# Altium schematic sheet memory.SchDoc
size A; SheetNumber: 2; SheetTotal: 3
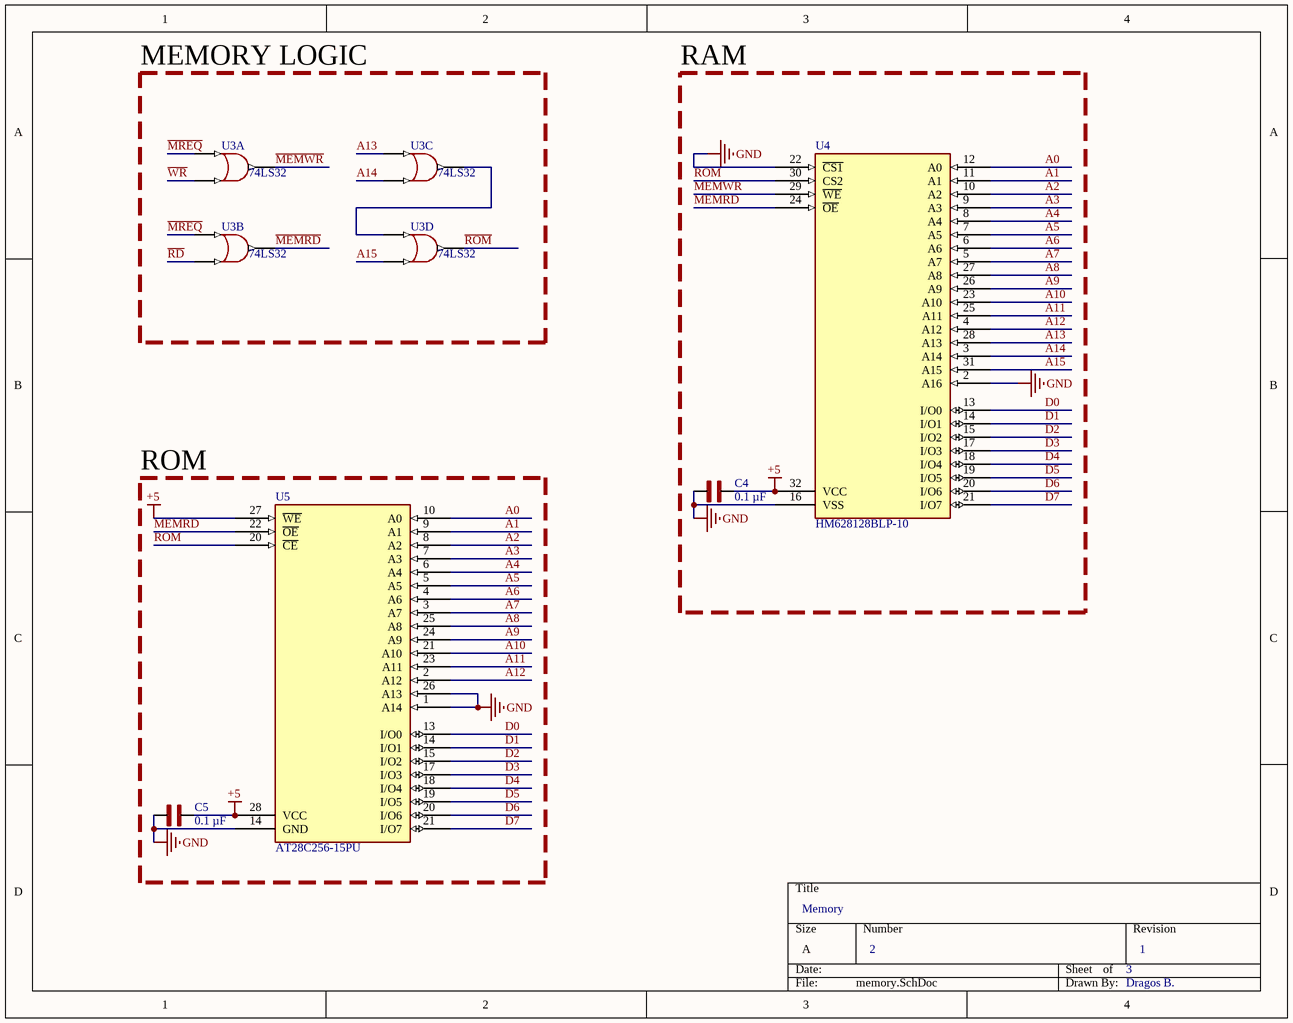
[diagram p0: memory.SchDoc]

## Parts
C4  0.1 µF  [Capacitor]
C5  0.1 µF  [Capacitor]
U3  74LS32  [DIP14]  (parts A,B,C,D of 5)
U4  HM628128BLP-10  [DIP32]
U5  AT28C256-15PU  [DIP28]

## Blocks framed on the sheet
MEMORY LOGIC: U3
RAM: C4 U4
ROM: C5 U5

## Nets
+5: C4.2 C5.2 U4.32(VCC) U5.27(~{WE}) U5.28(VCC)
GND: C4.1 C5.1 U4.2(A16) U4.16(VSS) U4.22(~{CS1}) U5.1(A14) U5.14(GND) U5.26(A13)
~{MEMRD}: U3.6(Y2) U4.24(~{OE}) U5.22(~{OE})
~{MEMWR}: U3.3(Y1) U4.29(~{WE})
~{MREQ}: U3.1(A1) U3.4(A2)
~{RD}: U3.5(B2)
~{ROM}: U3.11(Y4) U4.30(CS2) U5.20(~{CE})
~{WR}: U3.2(B1)
A0: U4.12(A0) U5.10(A0)
A1: U4.11(A1) U5.9(A1)
A2: U4.10(A2) U5.8(A2)
A3: U4.9(A3) U5.7(A3)
A4: U4.8(A4) U5.6(A4)
A5: U4.7(A5) U5.5(A5)
A6: U4.6(A6) U5.4(A6)
A7: U4.5(A7) U5.3(A7)
A8: U4.27(A8) U5.25(A8)
A9: U4.26(A9) U5.24(A9)
A10: U4.23(A10) U5.21(A10)
A11: U4.25(A11) U5.23(A11)
A12: U4.4(A12) U5.2(A12)
A13: U3.9(A3) U4.28(A13)
A14: U3.10(B3) U4.3(A14)
A15: U3.13(B4) U4.31(A15)
D0: U4.13(I/O0) U5.13(I/O0)
D1: U4.14(I/O1) U5.14(I/O1)
D2: U4.15(I/O2) U5.15(I/O2)
D3: U4.17(I/O3) U5.17(I/O3)
D4: U4.18(I/O4) U5.18(I/O4)
D5: U4.19(I/O5) U5.19(I/O5)
D6: U4.20(I/O6) U5.20(I/O6)
D7: U4.21(I/O7) U5.21(I/O7)
NetU3_8: U3.8(Y3) U3.12(A4)

## Notes on the sheet
- Memory
- 2
- 3
- 1
- Dragos B.

## Library data of the parts
C4 C5 = CAPACITOR: MP: ECWFG70105K; MF: Panasonic; SnapEDA_Link: https://www.snapeda.com/parts/ECWFG70105K/Panasonic/view-part/?ref=snap; Availability: In Stock; Price: None; Check_prices: https://www.snapeda.com/parts/ECWFG70105K/Panasonic/view-part/?ref=eda; Value: *; Purchase-URL: https://pricing.snapeda.com/search/part/ECWFG70105K/?ref=eda; Package: MOLDED-2 Panasonic